# Altium schematic sheet pyra_dvt1_power.SchDoc
size C; SheetNumber: 1; SheetTotal: 1
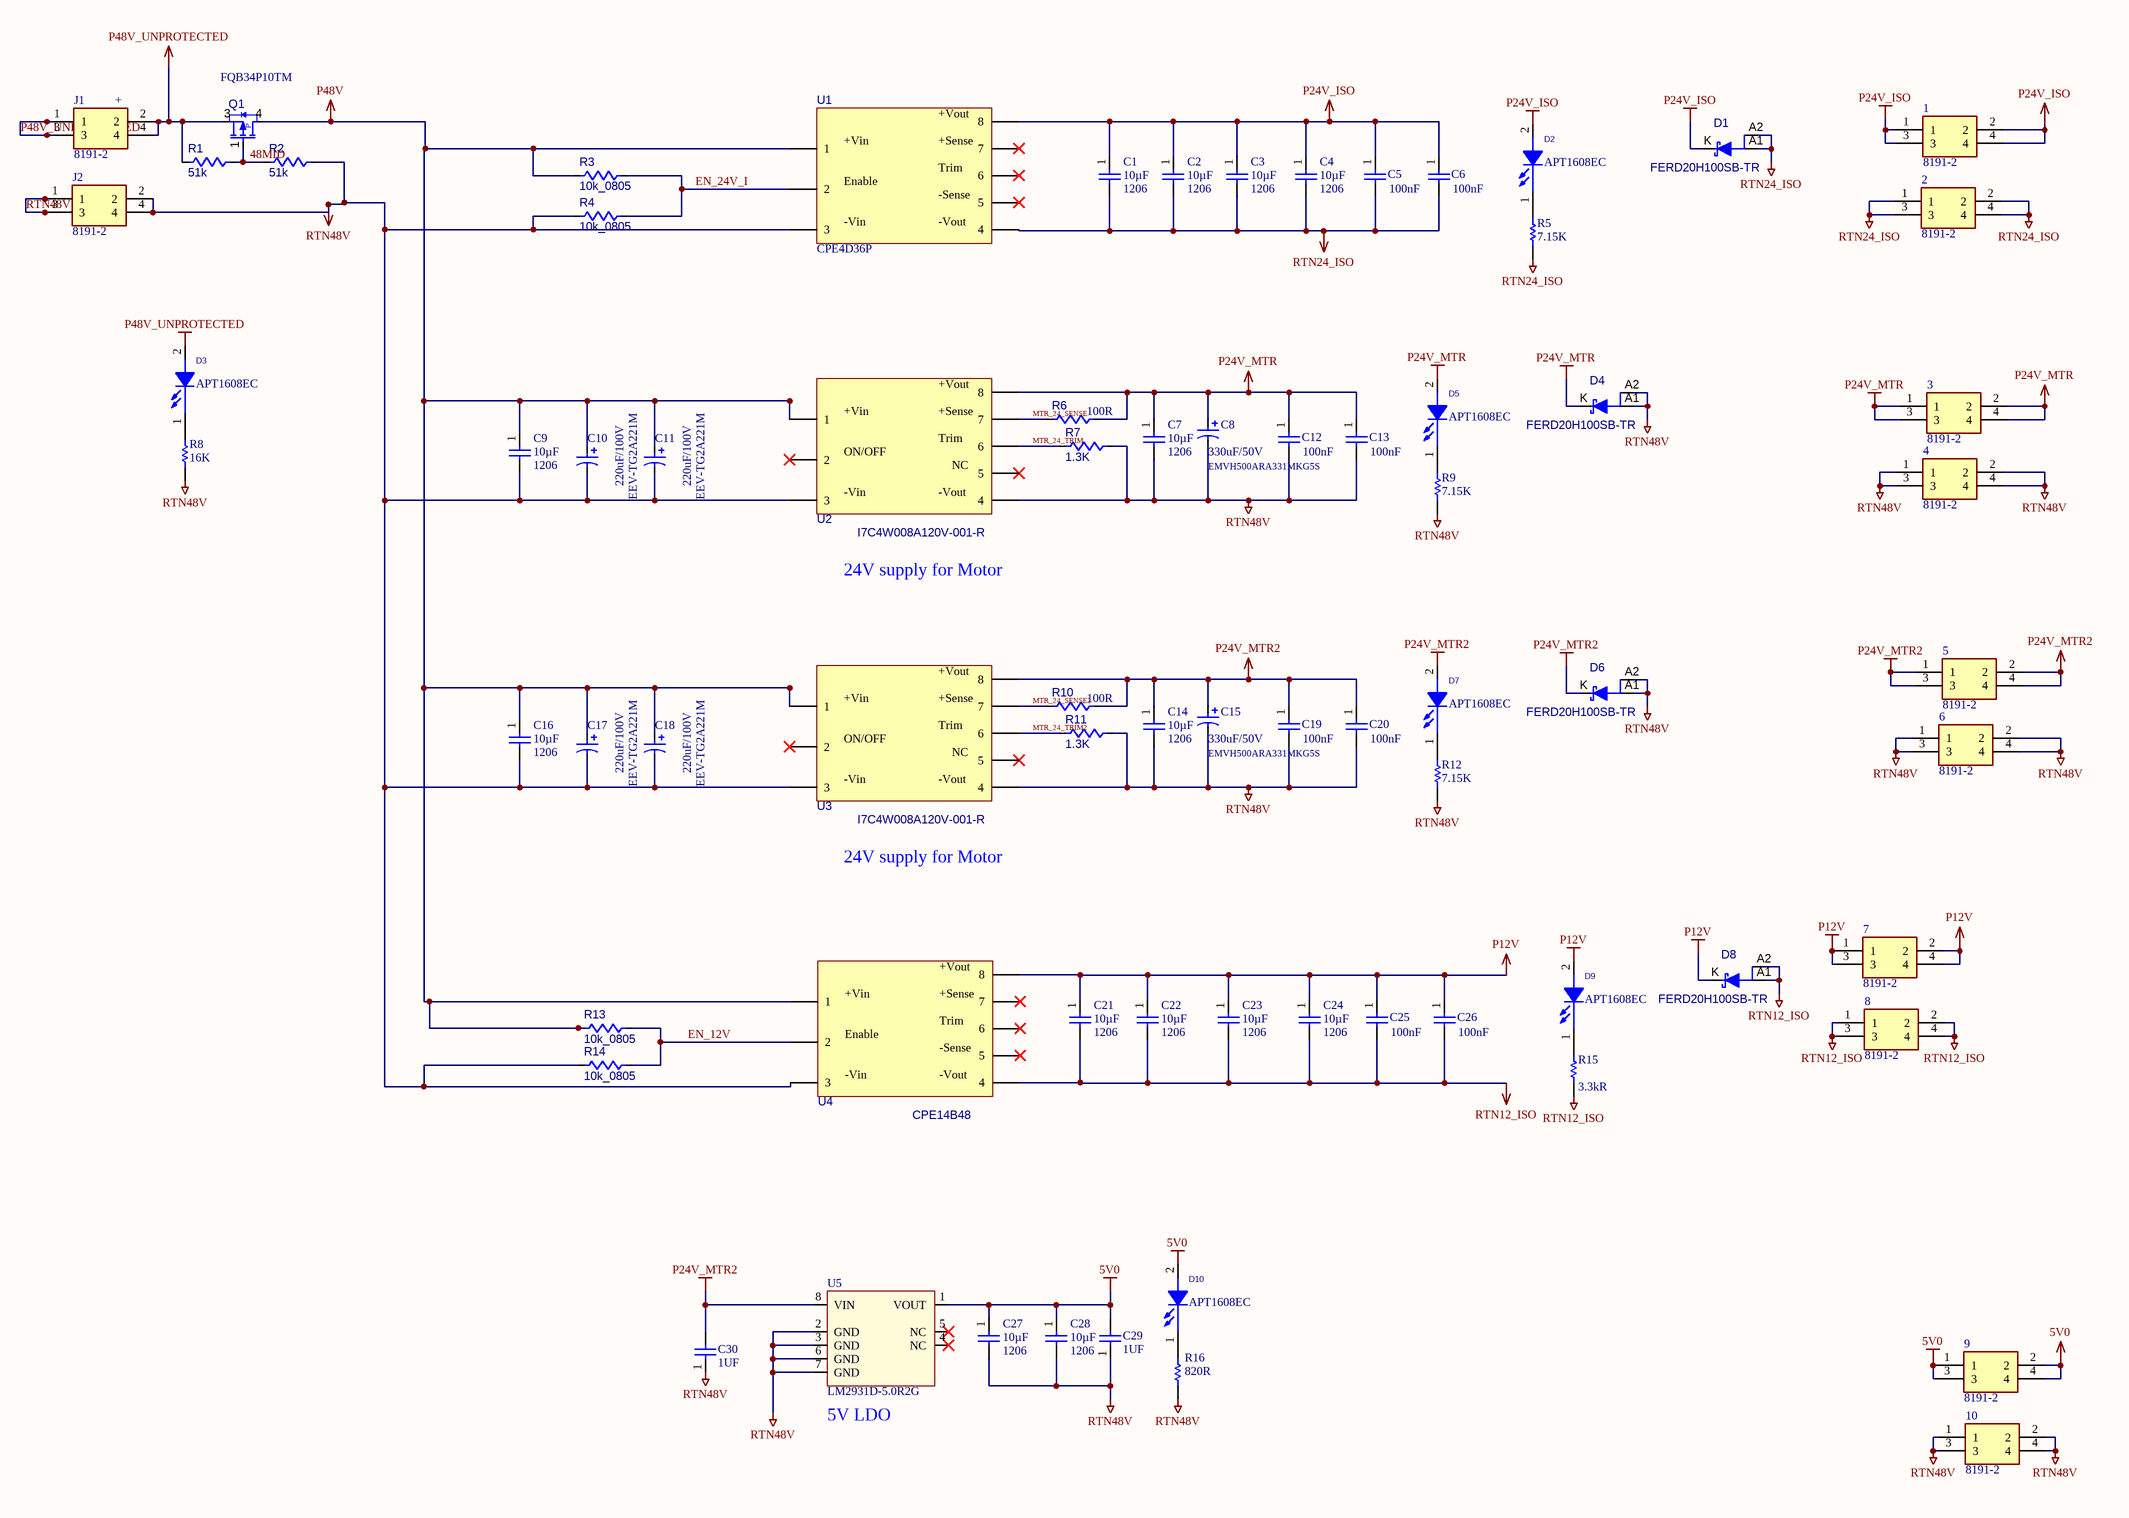
[diagram p0: pyra_dvt1_power.SchDoc]

## Parts
1  8191-2  [81912]
2  8191-2  [81912]
3  8191-2  [81912]
4  8191-2  [81912]
5  8191-2  [81912]
6  8191-2  [81912]
7  8191-2  [81912]
8  8191-2  [81912]
9  8191-2  [81912]
10  8191-2  [81912]
C1  value 10µF  [1206]  (hidden comment: C1206_10UF_50V)
C2  value 10µF  [1206]  (hidden comment: C1206_10UF_50V)
C3  value 10µF  [1206]  (hidden comment: C1206_10UF_50V)
C4  value 10µF  [1206]  (hidden comment: C1206_10UF_50V)
C5  value 100nF  [0603R(1608)]  (hidden comment: C0603_100NF_50V)
C6  value 100nF  [0603R(1608)]  (hidden comment: C0603_100NF_50V)
C7  value 10µF  [1206]  (hidden comment: C1206_10UF_50V)
C8  330uF/50V  [EMVH500ARA331MKG5S]
C9  value 10µF  [1206]  (hidden comment: C1206_10UF_50V)
C10  220uF/100V  Manufacturer Part Number: EEV-TG2A221M  [EMVH101GDA221MMN0S]
C11  220uF/100V  Manufacturer Part Number: EEV-TG2A221M  [EMVH101GDA221MMN0S]
C12  value 100nF  [0603R(1608)]  (hidden comment: C0603_100NF_50V)
C13  value 100nF  [0603R(1608)]  (hidden comment: C0603_100NF_50V)
C14  value 10µF  [1206]  (hidden comment: C1206_10UF_50V)
C15  330uF/50V  [EMVH500ARA331MKG5S]
C16  value 10µF  [1206]  (hidden comment: C1206_10UF_50V)
C17  220uF/100V  Manufacturer Part Number: EEV-TG2A221M  [EMVH101GDA221MMN0S]
C18  220uF/100V  Manufacturer Part Number: EEV-TG2A221M  [EMVH101GDA221MMN0S]
C19  value 100nF  [0603R(1608)]  (hidden comment: C0603_100NF_50V)
C20  value 100nF  [0603R(1608)]  (hidden comment: C0603_100NF_50V)
C21  value 10µF  [1206]  (hidden comment: C1206_10UF_50V)
C22  value 10µF  [1206]  (hidden comment: C1206_10UF_50V)
C23  value 10µF  [1206]  (hidden comment: C1206_10UF_50V)
C24  value 10µF  [1206]  (hidden comment: C1206_10UF_50V)
C25  value 100nF  [0603R(1608)]  (hidden comment: C0603_100NF_50V)
C26  value 100nF  [0603R(1608)]  (hidden comment: C0603_100NF_50V)
C27  value 10µF  [1206]  (hidden comment: C1206_10UF_50V)
C28  value 10µF  [1206]  (hidden comment: C1206_10UF_50V)
C29  1UF  [0603R(1608)]
C30  1UF  [0603R(1608)]
D1  FERD20H100SB-TR  [FERD20H100SB-TR-DPAK]
D2  APT1608EC  [APT1608EC]
D3  APT1608EC  [APT1608EC]
D4  FERD20H100SB-TR  [FERD20H100SB-TR-DPAK]
D5  APT1608EC  [APT1608EC]
D6  FERD20H100SB-TR  [FERD20H100SB-TR-DPAK]
D7  APT1608EC  [APT1608EC]
D8  FERD20H100SB-TR  [FERD20H100SB-TR-DPAK]
D9  APT1608EC  [APT1608EC]
D10  APT1608EC  [APT1608EC]
J1  8191-2  [81912]
J2  8191-2  [81912]
Q1  Manufacturer Part Number: FQB34P10TM  [TO263-AB]  (hidden comment: ?)
R1  51k  [0805]
R2  51k  [0805]
R3  10k_0805  [0805]
R4  10k_0805  [0805]
R5  Resistance (Ohms): 7.15K  [0603R(1608)]  (hidden comment: 10k)
R6  Resistance: 100R  [0805]  (hidden comment: ?)
R7  1.3K  [0603R(1608)]
R8  Resistance (Ohms): 16K  [0603R(1608)]  (hidden comment: 10k)
R9  Resistance (Ohms): 7.15K  [0603R(1608)]  (hidden comment: 10k)
R10  Resistance: 100R  [0805]  (hidden comment: ?)
R11  1.3K  [0603R(1608)]
R12  Resistance (Ohms): 7.15K  [0603R(1608)]  (hidden comment: 10k)
R13  10k_0805  [0805]
R14  10k_0805  [0805]
R15  Resistance: 3.3kR  [0603R(1608)]  (hidden comment: Res0402_10.0K)
R16  Resistance (Ohms): 820R  [0603R(1608)]  (hidden comment: 120)
U1  CPE4D36P  [CPE4D36N]
U2  I7C4W008A120V-001-R  [CPT2D36P]
U3  I7C4W008A120V-001-R  [CPT2D36P]
U4  CPE14B48  [CPE4D36N]
U5  LM2931D-5.0R2G  [SOIC_8]

## Nets
5V0: 9.1 9.2 9.3 9.4 C27.1 C28.1 C29.2 D10.2(ANODE) U5.1(VOUT)
P12V: 7.1 7.2 7.3 7.4 C21.1 C22.1 C23.1 C24.1 C25.1 C26.1 D8.K(A) D9.2(ANODE) U4.8
P24V_ISO: 1.1 1.2 1.3 1.4 C1.1 C2.1 C3.1 C4.1 C5.1 C6.1 D1.K(A) D2.2(ANODE) U1.8
P24V_MTR: 3.1 3.2 3.3 3.4 C7.1 C8.1 C12.1 C13.1 D4.K(A) D5.2(ANODE) R6.2 U2.8
P24V_MTR2: 5.1 5.2 5.3 5.4 C14.1 C15.1 C19.1 C20.1 C30.2 D6.K(A) D7.2(ANODE) R10.2 U3.8 U5.8(VIN)
P48V: C9.1 C10.1 C11.1 C16.1 C17.1 C18.1 Q1.4(D) R3.1 R13.1 U1.1 U2.1 U3.1 U4.1
P48V_UNPROTECTED: D3.2(ANODE) J1.1 J1.2 J1.3 J1.4 Q1.3(S) R1.1
RTN12_ISO: 8.1 8.2 8.3 8.4 C21.2 C22.2 C23.2 C24.2 C25.2 C26.2 D8.A1(A) D8.A2(A) R15.1 U4.4
RTN24_ISO: 2.1 2.2 2.3 2.4 C1.2 C2.2 C3.2 C4.2 C5.2 C6.2 D1.A1(A) D1.A2(A) R5.2 U1.4
RTN48V: 4.1 4.2 4.3 4.4 6.1 6.2 6.3 6.4 10.1 10.2 10.3 10.4 C7.2 C8.2 C9.2 C10.2 C11.2 C12.2 C13.2 C14.2 C15.2 C16.2 C17.2 C18.2 C19.2 C20.2 C27.2 C28.2 C29.1 C30.1 D4.A1(A) D4.A2(A) D6.A1(A) D6.A2(A) J2.1 J2.2 J2.3 J2.4 R2.2 R4.1 R7.1 R8.2 R9.2 R11.1 R12.2 R14.1 R16.1 U1.3 U2.3 U2.4 U3.3 U3.4 U4.3 U5.2(GND) U5.3(GND) U5.6(GND) U5.7(GND)
48MID: Q1.1(G) R1.2 R2.1
EN_12V: R13.2 R14.2 U4.2
EN_24V_I: R3.2 R4.2 U1.2
MTR_24_SENSE: R6.1 U2.7
MTR_24_SENSE2: R10.1 U3.7
MTR_24_TRIM: R7.2 U2.6
MTR_24_TRIM2: R11.2 U3.6
NetD2_1: D2.1(CATHODE) R5.1
NetD3_1: D3.1(CATHODE) R8.1
NetD5_1: D5.1(CATHODE) R9.1
NetD7_1: D7.1(CATHODE) R12.1
NetD9_1: D9.1(CATHODE) R15.2
NetD10_1: D10.1(CATHODE) R16.2

Not connected (* = marked no-connect by the designer): U1 5* 6* 7*; U2 2* 5*; U3 2* 5*; U4 5* 6* 7*; U5 4(NC)* 5(NC)*

## Notes on the sheet
- (near J1) +
- 24V supply for Motor
- (near U5) 5V LDO
- (in symbol CPE4D36N) +Vout; +Vin; +Sense; Trim; Enable; -Sense; -Vin; -Vout
- (in symbol CPE8B48P) +Vout; +Vin; +Sense; Trim; Enable; -Sense; -Vin; -Vout
- (in symbol I7C4W008A120V-001-R) +Vout; +Vin; +Sense; Trim; ON/OFF; NC; -Vin; -Vout
- (in symbol TRANS MOSFET-P_SI4128DY-T1-E3) P

## Library data of the parts
1-10 J1 J2 = CMP-002-000000-1: Keystone, Brass Screw Terminal, 22  14 AWG, 15A; Manufacturer_Name: Keystone Electronics; Geometry.Height: 11.176mm; Manufacturer_Part_Number: 8191-2; Source: 8191-2.SchLib; Mouser Price/Stock: https://www.mouser.co.uk/ProductDetail/Keystone-Electronics/8191-2?qs=zBlGwAMnvtcLi4%252BTp6EI2A%3D%3D; Datasheet Link: *; Design Item ID: 8191-2; Mouser Part Number: 534-8191-2
C1-C4 C7 C9 C14 C16 C21-C24 C27 C28 = C1206_10UF_50V: CAP CER 10UF 50V X5R 1206; Manufacturer: TDK Corporation; Manufacturer Part Number: C3216X5R1H106M160AB; Manufacturer Two: Any equivalent to description; Manufacturer Two Part Number: Per manufacturer; Tolerance: ±20%; Supplier 1: Digi-Key; Supplier Part Number 1: 445-5999-1-ND; RoHS: RoHS Compliant; Category: Capacitors; Stock 1: 17969; Pricing 1: 1=0.93, 10=0.706, 100=0.5053, 1000=0.33689 (USD); Packaging: Cut Tape (CT); Part Status: Active; Capacitance: 10µF; Temperature Coefficient: X5R; Operating Temperature: -55°C ~ 85°C; Features: Low ESL; Ratings: -; Applications: General Purpose; Failure Rate: -; Mounting Type: Surface Mount, MLCC; Package / Case: 1206 (3216 Metric); Size / Dimension: 0.126" L x 0.063" W (3.20mm x 1.60mm); Height - Seated (Max): -; Thickness (Max): 0.071" (1.80mm); Lead Spacing: -; Lead Style: -; ComponentLink1URL: https://product.tdk.com/info/en/catalog/datasheets/mlcc_commercial_general_en.pdf; ComponentLink1Description: https://product.tdk.com/info/en/catalog/datasheets/mlcc_commercial_general_en.pdf; Voltage - Rated: 50V; Size: 1206
C5 C6 C12 C13 C19 C20 C25 C26 = C0603_100NF_50V: CAP CER 0.1UF 50V X5R 0603; Manufacturer: TDK Corporation; Manufacturer Part Number: CGA3E2X5R1H104K080AA; Manufacturer Two: Any equivalent to description; Manufacturer Two Part Number: Per manufacturer; Capacitance: 0.1µF; Tolerance: ±10%; Supplier 1: Digi-Key; Supplier Part Number 1: 445-12498-1-ND; RoHS: RoHS Compliant; Category: Capacitors; Stock 1: 8997; Pricing 1: 1=0.1, 10=0.076, 25=0.0552, 50=0.0414, 100=0.0338, 250=0.02828, 500=0.02416, 1000=0.01898 (USD); Packaging: Cut Tape (CT); Part Status: Active; Voltage - Rated: 50V; Temperature Coefficient: X5R; Operating Temperature: -55°C ~ 85°C; Features: -; Ratings: AEC-Q200; Applications: Automotive; Failure Rate: -; Mounting Type: Surface Mount, MLCC; Package / Case: 0603 (1608 Metric); Size / Dimension: 0.063" L x 0.031" W (1.60mm x 0.80mm); Height - Seated (Max): -; Thickness (Max): 0.035" (0.90mm); Lead Spacing: -; Lead Style: -; ComponentLink1URL: https://product.tdk.com/info/en/catalog/datasheets/mlcc_automotive_general_en.pdf; ComponentLink1Description: https://product.tdk.com/info/en/catalog/datasheets/mlcc_automotive_general_en.pdf
C8 C15 = CAP POLAR  330uF: CAP ALUM 330UF 20% 50V SMD; Manufacturer: United Chemi-con; _Verified Footprint: .mfr-pn? footprint?; _Verified Symbol: .mfr-pn?; Life (Hours): 5000Hour; Ripple Current: 350mA; Leakage Current: 4uA; _Verified BOM: .mfr-pn?; Supplier 1: Digi-Key; Supplier Part Number 1: 565-2329-2-ND; Manufacturer Part Number: EMVH500ARA331MKG5S; RoHS: Yes; Category: Aluminum Electrolytic Capacitors; Stock 1: 1200; Case/Package: Radial; Number of Pins: 2; Min Operating Temperature: -40°C; Max Operating Temperature: 125°C; Package Quantity: 200; Tolerance: 20%; Voltage Rating (DC): 50V; Packaging: Tape and Reel; Capacitance: 330uF; Voltage Rating: 50V; Termination: SMD/SMT; Diameter: 12.5mm; Length: 13mm; Height: 13mm; Radiation Hardening: No; Lead Free: Lead Free; ComponentLink1Description: https://www.chemi-con.com/upload/files/9/3/45226975052d6c71e04ba0.pdf; ComponentLink1URL: https://www.chemi-con.com/upload/files/9/3/45226975052d6c71e04ba0.pdf
C10 C11 C17 C18 = CAP POLAR  220uF: CAP ALUM 220UF 20% 100V SMD; Manufacturer: Panasonic; _Verified Footprint: .mfr-pn? footprint?; _Verified Symbol: .mfr-pn?; Life (Hours): 5000Hour; Ripple Current: 400mA; Leakage Current: 4uA; _Verified BOM: .mfr-pn?; Supplier 1: Digi-Key; Supplier Part Number 1: PCE3698TR-ND; RoHS: Yes; Category: Aluminum Electrolytic Capacitors; Stock 1: 875; Case/Package: Radial; Number of Pins: 2; Min Operating Temperature: -40°C; Max Operating Temperature: 125°C; Package Quantity: 125; Tolerance: 20%; Voltage Rating (DC): 100V; Packaging: Tape and Reel; Capacitance: 220uF; Voltage Rating: 100V; Termination: SMD/SMT; Diameter: 18mm; Length: 16.5mm; Height: 16.5mm; Radiation Hardening: No; Lead Free: Lead Free
  C10 C17: ComponentLink1Description: https://www.chemi-con.com/upload/files/9/3/45226975052d6c71e04ba0.pdf; ComponentLink1URL: https://www.chemi-con.com/upload/files/9/3/45226975052d6c71e04ba0.pdf
  C11 C18: ComponentLink1Description: https://industrial.panasonic.com/cdbs/www-data/pdf/RDE0000/ABA0000C1187.pdf; ComponentLink1URL: https://industrial.panasonic.com/cdbs/www-data/pdf/RDE0000/ABA0000C1187.pdf*
C29 C30 = C0603_1UF_50V: CAP CER 1UF 50V X5R 0603; Manufacturer 1: TDK; Manufacturer Part Number 1: CGA3E3X5R1H105K080AB; Tolerance: 10%; ComponentLink1URL: https://product.tdk.com/info/en/catalog/datasheets/mlcc_automotive_general_en.pdf; ComponentLink1Description: https://product.tdk.com/info/en/catalog/datasheets/mlcc_automotive_general_en.pdf; Mount: Surface Mount; Case/Package: 0603; Weight: 7.1E-05oz; Case Code (Imperial): 0603; Case Code (Metric): 1608; Min Operating Temperature: -55°C; Max Operating Temperature: 85°C; Capacitance: 1uF; Voltage Rating: 50V; Voltage Rating (DC): 50V; Packaging: Tape and Reel; Package Quantity: 1; Termination: SMD/SMT; Composition: Ceramic; Dielectric: X5R; Length: 1.6mm; Height: 0.8mm; Width: 0.8mm; Thickness: 0.031inch; Depth: 0.8mm; Ratings: AEC-Q200; Lead Free: Lead Free; REACH SVHC: No SVHC; ComponentLink2URL: https://datasheet.ciiva.com/24218/cga3e3x5r1h105k080ab-265988-24218999.pdf?src-supplier=Mouser; ComponentLink2Description: https://datasheet.ciiva.com/24218/cga3e3x5r1h105k080ab-265988-24218999.pdf?src-supplier=Mouser; ComponentLink3URL: https://datasheet.ciiva.com/7975/1807242-7975388.pdf?src-supplier=Element14; ComponentLink3Description: https://datasheet.ciiva.com/7975/1807242-7975388.pdf?src-supplier=Element14; Supplier 1: Digi-Key; Supplier Part Number 1: 445-7878-1-ND; RoHS: Yes; Category: Ceramic Capacitors; Stock 1: 200723; Pricing 1: 1=0.25000, 10=0.17300, 50=0.11560, 100=0.09820, 500=0.06930, 1000=0.06064 (USD); Manufacturer: TDK; Manufacturer Part Number: CGA3E3X5R1H105K080AB
D1 D4 D6 D8 = DIO DPAK: DIODE RECT 100V 20A DPAK; Manufacturer: ST Micro; _Verified Footprint: .mfr-pn? footprint?; _Verified BOM: .mfr-pn?; _Verified Symbol: .mfr-pn?; ComponentLink1Description: https://www.st.com/content/ccc/resource/technical/document/datasheet/group3/c3/5d/fd/bb/1c/52/46/a2/DM00272110/files/DM00272110.pdf/jcr:content/translations/en.DM00272110.pdf; ComponentLink1URL: https://www.st.com/content/ccc/resource/technical/document/datasheet/group3/c3/5d/fd/bb/1c/52/46/a2/DM00272110/files/DM00272110.pdf/jcr:content/translations/en.DM00272110.pdf; Current Rating: 20A; Manufacturer Part Number: FERD20H100SB-TR; Max Operating Temperature: 175°C; Mount: Surface Mount; Number of Pins: 3; Package / Case: DPAK; Packaging: Cut Tape (CT); Part Status: Active; RoHS: RoHS Compliant; Supplier 1: Digi-Key; Supplier Part Number 1: 497-16946-1-ND; Voltage Rating (AC): 100V; Voltage Rating (DC): 100V; Voltage Rating: 100V; Working Voltage: 100V
D2 D3 D5 D7 D9 D10 = LED_red_0603: red, 0603; Manufacturer: Kingbright; Lens Color: Clear; Forward Current: 20mA; Forward Voltage: 2V; Luminous Intensity: 12mcd; Viewing Angle: 120°; Lens Style: Clear,Flat; Dominant Wavelength: 625nm; Number of LEDs: 1; Manufacturer Part Number: APT1608EC; Supplier 1: Digi-Key; Supplier Part Number 1: 754-1117-6-ND; Stock 1: 93649; Pricing 1: 1=0.35, 10=0.259, 25=0.1912, 100=0.1365, 250=0.09284, 500=0.0819, 1000=0.06416 (USD); Mount: Surface Mount; Case/Package: 0603; Number of Pins: 2; Color: Red; Case Code (Metric): 1608; Case Code (Imperial): 0603; Min Operating Temperature: -40°C; Max Operating Temperature: 85°C; Illumination Color: Red; Packaging: Tape and Reel; Package Quantity: 2000; Test Current: 20mA; Wavelength: 625nm; Length: 1.6mm; Height: 0.75mm; Width: 0.8mm; Lead Free: Lead Free; ComponentLink1URL: http://www.kingbrightusa.com/images/catalog/SPEC/APT1608EC.pdf?src-supplier=Digi-Key; ComponentLink1Description: http://www.kingbrightusa.com/images/catalog/SPEC/APT1608EC.pdf?src-supplier=Digi-Key; ComponentLink2URL: https://www.alliedelec.com/m/d/8f77ba6adbc677900716b25e6ddbc771.pdf?src-supplier=Allied+Electronics; ComponentLink2Description: https://www.alliedelec.com/m/d/8f77ba6adbc677900716b25e6ddbc771.pdf?src-supplier=Allied+Electronics; ComponentLink3URL: http://www.kingbrightusa.com/images/catalog/SPEC/APT1608EC.pdf?src-supplier=Future+Electronics; ComponentLink3Description: http://www.kingbrightusa.com/images/catalog/SPEC/APT1608EC.pdf?src-supplier=Future+Electronics
Q1 = TRANS MOSFET-P_SI4128DY-T1-E3: Trans MOSFET P-CH 100V 33.5A 3-Pin(2+Tab) D2PAK T/R / MOSFET P-CH 100V 33.5A D2PAK; Manufacturer: ON Semiconductor / Fairchild; Rds On Max: 60mR; Input Capacitance: 2.91nF; Max Power Dissipation: 3.75W; Rise Time: 250ns; Number of Elements: 1; Fall Time: 210ns; Turn-Off Delay Time: 160ns; Turn-On Delay Time: 25ns; Element Configuration: Single; Drain to Source Breakdown Voltage: -100V; Gate to Source Voltage (Vgs): 25V; Polarity: P-CHANNEL; Nominal Vgs: 4V; Current Rating: -34A; Supplier 1: Digi-Key; Supplier Part Number 1: FQB34P10TMCT-ND; RoHS: Yes; Category: Integrated Circuits (ICs); Stock 1: 2608; Pricing 1: 1=2.80000, 10=2.51600, 100=2.02220 (USD); Mount: Surface Mount; Case/Package: TO-263; Number of Pins: 3; Weight: 1.31247g; Min Operating Temperature: -55°C; Max Operating Temperature: 175°C; Drain to Source Voltage (Vdss): 100V; Continuous Drain Current (ID): 33.5A; Packaging: Tape and Reel; Package Quantity: 1; Drain to Source Resistance: 60mR; Power Dissipation: 3.75W; Series: QFET®; Threshold Voltage: 4V; Voltage Rating (DC): -100V; On-State Resistance: 60mR; Drain-source On Resistance-Max: 60mR; Length: 10.67mm; Width: 9.65mm; Height: 4.83mm; Radiation Hardening: No; RoHS Compliant: Yes; REACH SVHC: No SVHC; Lead Free: Lead Free; ComponentLink1URL: https://datasheet.ciiva.com/4440/fqb34p10-110600-4440849.pdf?src-supplier=Mouser; ComponentLink1Description: https://datasheet.ciiva.com/4440/fqb34p10-110600-4440849.pdf?src-supplier=Mouser; ComponentLink2URL: https://datasheet.ciiva.com/16743/fqb34p10tm-16743578.pdf?src-supplier=Future+Electronics; ComponentLink2Description: https://datasheet.ciiva.com/16743/fqb34p10tm-16743578.pdf?src-supplier=Future+Electronics; ComponentLink3URL: https://datasheet.ciiva.com/22671/1788504-22671976.pdf?src-supplier=Element14; ComponentLink3Description: https://datasheet.ciiva.com/22671/1788504-22671976.pdf?src-supplier=Element14; ComponentLink4URL: https://datasheet.ciiva.com/1256/1725742-1256197.pdf?src-supplier=Newark; ComponentLink4Description: https://datasheet.ciiva.com/1256/1725742-1256197.pdf?src-supplier=Newark; ComponentLink5URL: https://datasheet.ciiva.com/23855/fqb34p10-23855443.pdf?src-supplier=Newark; ComponentLink5Description: https://datasheet.ciiva.com/23855/fqb34p10-23855443.pdf?src-supplier=Newark; ComponentLink6URL: https://datasheet.ciiva.com/11175/fqb34p10-11175917.pdf?src-supplier=Avnet; ComponentLink6Description: https://datasheet.ciiva.com/11175/fqb34p10-11175917.pdf?src-supplier=Avnet; ComponentLink7URL: https://datasheet.ciiva.com/6376/fqb34p10-6376523.pdf?src-supplier=Digi-Key; ComponentLink7Description: https://datasheet.ciiva.com/6376/fqb34p10-6376523.pdf?src-supplier=Digi-Key; ComponentLink8URL: https://datasheet.ciiva.com/6376/fqb34p10-6376525.pdf?src-supplier=Digi-Key; ComponentLink8Description: https://datasheet.ciiva.com/6376/fqb34p10-6376525.pdf?src-supplier=Digi-Key; ComponentLink9URL: https://datasheet.ciiva.com/8115/fqb34p10-8115964.pdf?src-supplier=Avnet; ComponentLink9Description: https://datasheet.ciiva.com/8115/fqb34p10-8115964.pdf?src-supplier=Avnet; ComponentLink10URL: https://datasheet.ciiva.com/28612/1788504-28612364.pdf?src-supplier=Element14; ComponentLink10Description: https://datasheet.ciiva.com/28612/1788504-28612364.pdf?src-supplier=Element14
R1 R2 = RES 51k: Res Thick Film 0805 51K Ohm 1% 1/8W ±100ppm/°C Molded SMD Punched Carrier T/R; Manufacturer: Panasonic; Manufacturer Part Number: ERJ-6ENF5102V; Resistance: 51kR; Power Rating: 125mW; Voltage Rating: 150V; Supplier 1: Digi-Key; RoHS: Yes; Category: Chip SMD Resistors; Stock 1: 4115; Pricing 1: 1=0.10000, 10=0.08200, 100=0.03160, 1000=0.01392, 2500=0.01202 (USD); Mount: Surface Mount; Case/Package: 0805; Case Code (Imperial): 0805; Case Code (Metric): 2012; Min Operating Temperature: -55°C; Max Operating Temperature: 155°C; Tolerance: 1%; Resistor Type: Thick Film; Temperature Coefficient: 100ppm/°C; Packaging: Tape and Reel; Package Quantity: 1; Number of Terminations: 2; Termination: SMD/SMT; Max Power Dissipation: 125mW; Voltage Rating (DC): 150V; Features: Automotive AEC-Q200; Series: ERJ; Construction: Rectangular; Resistance Tolerance: 1%; Technology: THICK FILM; Length: 2mm; Width: 1.2mm; Height: 0.6mm; Depth: 1.25mm; Radiation Hardening: No; REACH SVHC: No SVHC; Military Standard: Not; RoHS Compliant: Yes; ComponentLink1URL: https://datasheet.ciiva.com/11821/0900766b80f80784-11821667.pdf?src-supplier=RSComponents; ComponentLink1Description: https://datasheet.ciiva.com/11821/0900766b80f80784-11821667.pdf?src-supplier=RSComponents; ComponentLink2URL: https://datasheet.ciiva.com/46381/1678782-46381561.pdf?src-supplier=Element14; ComponentLink2Description: https://datasheet.ciiva.com/46381/1678782-46381561.pdf?src-supplier=Element14; ComponentLink3URL: https://datasheet.ciiva.com/22682/1678782-22682207.pdf?src-supplier=Element14; ComponentLink3Description: https://datasheet.ciiva.com/22682/1678782-22682207.pdf?src-supplier=Element14; Supplier Part Number 1: P51.0KCCT-ND; Contact Plating: Tin
R3 R4 R13 R14 = RES 10k_0805: Res Thick Film 0805 10K Ohm 1% 0.125W ±100ppm/°C Molded SMD Paper T/R; Manufacturer: Stackpole Electronics; Manufacturer Part Number: RMCF0805FT10K0; Resistance: 10kR; Power Rating: 125mW; ComponentLink1URL: https://datasheet.ciiva.com/11821/0900766b80f80784-11821667.pdf?src-supplier=RSComponents; ComponentLink1Description: https://datasheet.ciiva.com/11821/0900766b80f80784-11821667.pdf?src-supplier=RSComponents; ComponentLink2URL: https://datasheet.ciiva.com/46381/1678782-46381561.pdf?src-supplier=Element14; ComponentLink2Description: https://datasheet.ciiva.com/46381/1678782-46381561.pdf?src-supplier=Element14; ComponentLink3URL: https://datasheet.ciiva.com/22682/1678782-22682207.pdf?src-supplier=Element14; ComponentLink3Description: https://datasheet.ciiva.com/22682/1678782-22682207.pdf?src-supplier=Element14; ComponentLink4URL: https://datasheet.ciiva.com/46381/1678782-46381560.pdf?src-supplier=Element14; ComponentLink4Description: https://datasheet.ciiva.com/46381/1678782-46381560.pdf?src-supplier=Element14; ComponentLink5URL: https://datasheet.ciiva.com/24026/aoa0000ce2-24026488.pdf?src-supplier=Mouser; ComponentLink5Description: https://datasheet.ciiva.com/24026/aoa0000ce2-24026488.pdf?src-supplier=Mouser; ComponentLink6URL: https://datasheet.ciiva.com/16788/70260748-16788109.pdf?src-supplier=Allied+Electronics; ComponentLink6Description: https://datasheet.ciiva.com/16788/70260748-16788109.pdf?src-supplier=Allied+Electronics; ComponentLink7URL: https://datasheet.ciiva.com/16774/70260748-16774949.pdf?src-supplier=Allied+Electronics; ComponentLink7Description: https://datasheet.ciiva.com/16774/70260748-16774949.pdf?src-supplier=Allied+Electronics; ComponentLink8URL: https://datasheet.ciiva.com/30051/aoa0000ce2-30051758.pdf?src-supplier=Onlinecomponents.com; ComponentLink8Description: https://datasheet.ciiva.com/30051/aoa0000ce2-30051758.pdf?src-supplier=Onlinecomponents.com; ComponentLink9URL: https://datasheet.ciiva.com/17209/aoa0000ce2-17209430.pdf?src-supplier=Avnet+Europe; ComponentLink9Description: https://datasheet.ciiva.com/17209/aoa0000ce2-17209430.pdf?src-supplier=Avnet+Europe; Supplier 1: Digi-Key; RoHS: Yes; Category: Chip SMD Resistors; Stock 1: 10552273; Pricing 1: 5000=0.00350 (USD); Mount: Surface Mount; Case/Package: 0805; Case Code (Metric): 2012; Case Code (Imperial): 0805; Contact Plating: Tin,Matte; Size Code: 0805; Min Operating Temperature: -55°C; Max Operating Temperature: 155°C; Tolerance: 1%; Packaging: Tape and Reel; Resistor Type: Thick Film; Number of Terminations: 2; Temperature Coefficient: 100ppm/°C; Max Power Dissipation: 125mW; Features: Automotive AEC-Q200; Series: RMCF; Construction: Rectangular; Length: 2mm; Width: 0.049inch; Height: 0.026inch; Depth: 1.25mm; Radiation Hardening: No; Lead Free: Lead Free; Military Standard: Not; RoHS Compliant: Yes; ComponentLink10URL: https://datasheet.ciiva.com/15193/getdatasheetpartid-362046-15193525.pdf?src-supplier=Verical; ComponentLink10Description: https://datasheet.ciiva.com/15193/getdatasheetpartid-362046-15193525.pdf?src-supplier=Verical; Supplier Part Number 1: RMCF0805FT10K0TR-ND
R5 R8 R9 R12 = RES-0603-10K_1: RES SMD 10K OHM 5% 1/10W 0603; Manufacturer: Panasonic Electronic Components; Manufacturer Part Number: RMCF0603FT7K15; Manufacturer Two: Any equivalent to description; Manufacturer Two Part Number: Per manufacturer; Tolerance: ±1%; Proto Cost @ 100: 0.0068; Temperature Coefficient: ±100ppm/°C; Power (Watts): 0.1W, 1/10W; Symbol Revision Notes: *; Pin Count: 2; RoHS: RoHS Compliant; Supplier 1: Digi-Key; Packaging: Cut Tape (CT); Series: RMC; Supplier Part Number 1: RMCF0603FT7K15TR-ND; Package / Case: 0603 (1608 Metric); Size / Dimension: 0.063" L x 0.031" W (1.60mm x 0.80mm); Validated: -; Height: 0.022" (0.55mm); Composition: Thick Film; ComponentLink1URL: http://industrial.panasonic.com/www-cgi/jvcr13pz.cgi?E+PZ+3+AOA0002+ERJ3EKF1200V+7+WW
R6 R10 = RES .val? 0805: RES 100 OHM 5% 1/4W 0805; Manufacturer: KOA; Manufacturer Part Number: RK73B2ATTD101J; _Verified Footprint: .mfr-pn? footprint?; _Verified BOM: .mfr-pn?; Max Power Dissipation: 250mW; Temperature Coefficient: 200ppm/°C; _Verified Symbol: .mfr-pn?; Supplier 1: Digi-Key; Supplier Part Number 1: 2019-RK73B2ATTD101JTR-ND; RoHS: Yes; Category: Chip SMD Resistors; Stock 1: 4773; Pricing 1: 1=0.14000, 10=0.12400, 100=0.04790, 1000=0.02105, 2500=0.01818 (USD); Case/Package: 0805; Case Code (Metric): 2012; Case Code (Imperial): 0805; Min Operating Temperature: -55°C; Max Operating Temperature: 155°C; Package Quantity: 1; Tolerance: 5%; Packaging: Tape and Reel; Resistor Type: Thick Film; Number of Terminations: 2; Features: Automotive AEC-Q200; Length: 0.079inch; Height: 0.024inch; Width: 0.049inch; ComponentLink1Description: https://www.koaspeer.com/pdfs/RK73B.pdf; ComponentLink1URL: https://www.koaspeer.com/pdfs/RK73B.pdf
R7 R11 = RES .val? .pkg?: RES SMD 1.3K OHM 1% 1/10W 0603; Manufacturer: Panasonic; Manufacturer Part Number: ERJ-3EKF1301V; _Verified Footprint: .mfr-pn? footprint?; _Verified Symbol: .mfr-pn?; Power Rating: 100mW; Temperature Coefficient: 100ppm/°C; _Verified BOM: .mfr-pn?; Supplier 1: Digi-Key; Supplier Part Number 1: P1.30KHTR-ND; RoHS: Yes; Category: Chip SMD Resistors; Mount: Surface Mount; Case/Package: 0603; Case Code (Metric): 1608; Case Code (Imperial): 0603; Min Operating Temperature: -55°C; Max Operating Temperature: 155°C; Resistance: 1.3K; Tolerance: 1%; Packaging: Tape and Reel; Composition: Thick Film; Number of Terminations: 2; Termination: Solder; Max Power Dissipation: 100mW; Length: 0.061inch; Height: 0.022inch; Width: 0.031inch; Depth: 0.8mm; REACH SVHC: No SVHC; ComponentLink1Description: https://industrial.panasonic.com/cdbs/www-data/pdf/RDA0000/AOA0000C304.pdf; ComponentLink1URL: https://industrial.panasonic.com/cdbs/www-data/pdf/RDA0000/AOA0000C304.pdf
R15 = Res0402_10.0K: Resistor;  Thick Film;  3.3 Kilohms;  0.1 W;  1%;  SMT;  0603;  TCR 37 ppm/DegC; Manufacturer 1: Vishay; Manufacturer Part Number 1: CRCW06033K30FKEA; Working Voltage: 75V; Temperature Coefficient: 100ppm/°C; Power Rating: 100mW; ComponentLink1URL: https://datasheet.ciiva.com/11809/0900766b80d98824-11809984.pdf; ComponentLink1Description: https://datasheet.ciiva.com/11809/0900766b80d98824-11809984.pdf; ComponentLink2URL: https://datasheet.ciiva.com/2463/dcrcwe3-2463025.pdf; ComponentLink2Description: https://datasheet.ciiva.com/2463/dcrcwe3-2463025.pdf; ComponentLink3URL: https://datasheet.ciiva.com/2463/dcrcwe3-2463026.pdf; ComponentLink3Description: https://datasheet.ciiva.com/2463/dcrcwe3-2463026.pdf; Technology: THIN FILM; Supplier 1: Digi-Key; Supplier Part Number 1: 541-3.30KHCT-ND; RoHS: Yes; Category: Chip SMD Resistors; Stock 1: 240962; Pricing 1: 1=0.10000, 10=0.03600, 100=0.01450, 1000=0.00652, 2500=0.00566 (USD); Mount: Surface Mount; Case/Package: 0603; Case Code (Imperial): 0603; Case Code (Metric): 1608; Contact Plating: Tin,Lead; Weight: 7.1E-05oz; Min Operating Temperature: -55°C; Max Operating Temperature: 155°C; Tolerance: 1%; Packaging: Tape and Reel; Resistor Type: Thick Film; Series: CRCW; Voltage Rating: 75V; Number of Terminations: 2; Max Power Dissipation: 100mW; Termination: SMD/SMT; Voltage Rating (DC): 75V; Package Quantity: 10; Construction: Rectangular; Resistance Tolerance: 1%; Features: Automotive AEC-Q200; Length: 1.55mm; Width: 0.85mm; Height: 0.45mm; Depth: 0.85mm; Radiation Hardening: No; RoHS Compliant: Yes; Lead Free: Lead Free; Military Standard: Not; REACH SVHC: Unknown; Manufacturer: Vishay; Manufacturer Part Number: CRCW06033K30FKEA
R16 = RES-00703: RES 120 OHM 1/10W 1% 0603 SMD; Part Number: CRCW0603820RJNEA; Manufacturer: Vishay Dale; Manufacturer Two: Any equivalent to description; Manufacturer Two Part Number: Per manufacturer; Tolerance: ±5%; Temperature Coefficient: ±200ppm/°C; Power (Watts): 0.1W, 1/10W; Manufacturer Part Number: CRCW0603820RJNEA; Pin Count: 2; RoHS: RoHS Compliant; Supplier 1: Digi-Key; Packaging: Cut Tape (CT); Series: CRCW; Supplier Part Number 1: 541-820GCT-ND; Package / Case: 0603 (1608 Metric); Size / Dimension: 0.063" L x 0.031" W (1.60mm x 0.80mm); Height: 0.022" (0.55mm); Composition: Thick Film; ComponentLink1URL: https://www.vishay.com/docs/20035/dcrcwe3.pdf; ComponentLink1Description: https://www.vishay.com/docs/20035/dcrcwe3.pdf; ComponentLink1URL: *
U1 = CPE4D36N: Isolated Module DC DC Converter 1 Output 24V    4A 18V - 72V Input; Manufacturer: Semiconductor Circuits, Inc.; Manufacture2: NetPower; Manufacturer2 Part Number: ERS3240N004N25W; Notes: NetPower fit R38 remove R37; Supplier 1: Digi-Key; Manufacturer Part Number: CPE4D36P; RoHS: No; Category: Board Mount Modules; Stock 1: 37
U2 U3 = I7C4W008A120V-001-R: DC DC CONVERTER 9.6-48V OUTPUT 300W 8A 9V - 53V INPUT; Manufacturer: TDK-Lambda; Supplier 1: Digikey; Manufacturer Part Number: I7C4W008A120V-001-R; RoHS: Yes; Category: Board Mount Modules
U4 = CPE8B48P: Isolated Module DC DC Converter 1 Output 12V    14A 36V - 75V Input; Manufacturer: Semiconductor Circuits, Inc.; Manufacturer Part Number: CPE14B48P; Manufacturer 2 Part Number: EBE4120N017N76; Alternate 3: Bel Fuse 0RCY-D4T12HG; Alternate 4: Flex Power PKB4413DAPIHS; notes: alternates stuff R40 remove R39; ComponentLink1Description: http://www.dcdc.com/PDF/CPE14B48_Datasheet_R_1.1.pdf; ComponentLink1URL: http://www.dcdc.com/PDF/CPE14B48_Datasheet_R_1.1.pdf; Manufacturer 2: NetPower
U5 = LM2931D-5.0R2G: IC REG LINEAR 5V 100MA 8SOIC; Manufacturer 1: ON Semi; Min Input Voltage: 14V; Max Input Voltage: 40V; Dropout Voltage: 600mV; Number of Outputs: 1; Quiescent Current: 100uA; Accuracy: 5%; Output Type: Fixed; Mount: Surface Mount; Case/Package: 8SOIC; Number of Pins: 8; Min Operating Temperature: -40°C; Max Operating Temperature: 125°C; Nominal Output Voltage: 5V; Output Current: 100mA; Packaging: Tape and Reel; Output Voltage: 5V; Max Output Current: 100mA; Length: 5mm; Height: 1.75mm; Width: 6.2mm; REACH SVHC: No SVHC; Supplier 1: Digi-Key; Supplier Part Number 1: LM2931D-5.0R2GOSTR-ND; Manufacturer Part Number 1: LM2931D-5.0R2G; RoHS: Yes; Category: Voltage Regulators - Linear; Stock 1: 1142; Pricing 1: 1=0.11000, 25=0.09000, 100=0.08000 (USD); Manufacturer: ON Semi; Manufacturer Part Number: LM2931D-5.0R2G; ComponentLink1Description: https://www.onsemi.com/pdf/datasheet/lm2931-d.pdf; ComponentLink1URL: https://www.onsemi.com/pdf/datasheet/lm2931-d.pdf